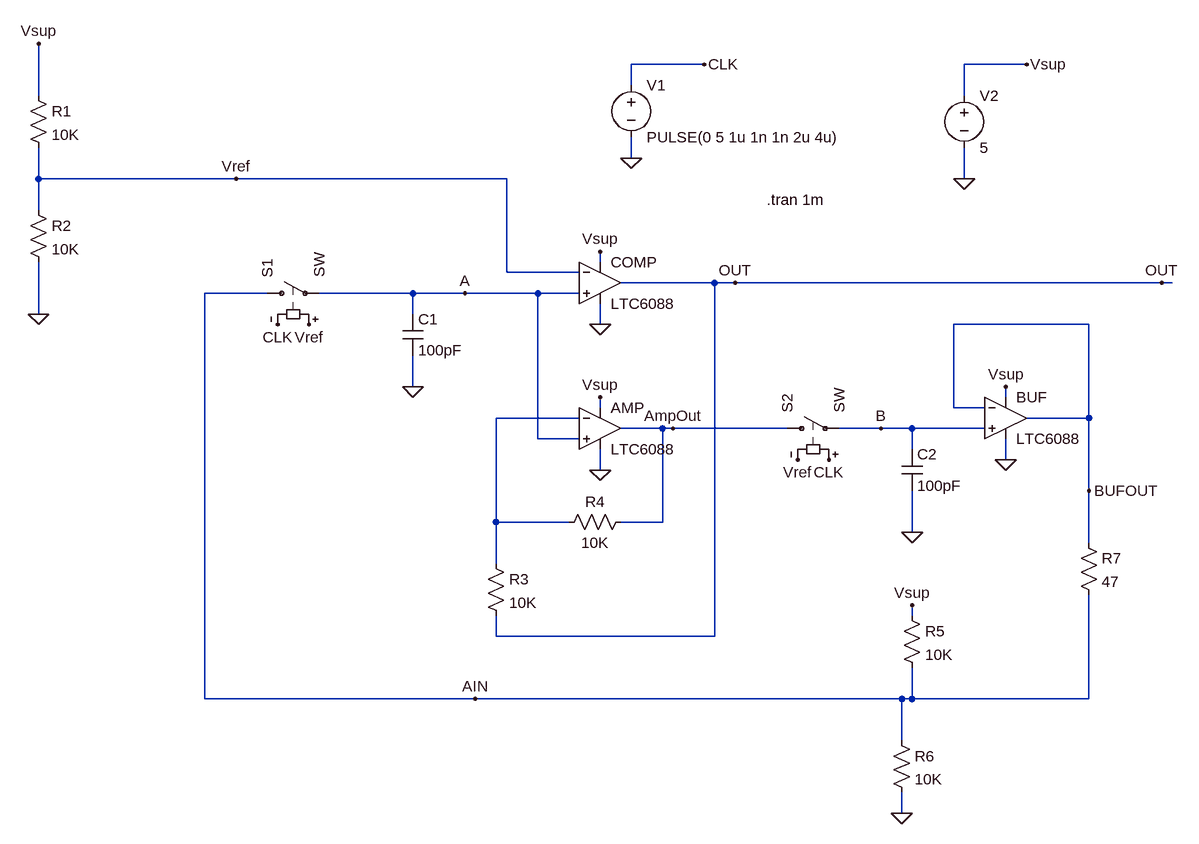
[diagram p0: schematic InfNoiseMult.asc]
InfNoiseMult.asc, the LTspice schematic file:
Version 4
SHEET 1 1396 1108
WIRE 384 -64 272 -64
WIRE 880 -64 784 -64
WIRE 272 -32 272 -64
WIRE -640 -16 -640 -96
WIRE 784 -16 784 -64
WIRE 272 80 272 48
WIRE -640 112 -640 64
WIRE -336 112 -640 112
WIRE 80 112 -336 112
WIRE 784 112 784 64
WIRE -640 160 -640 112
WIRE 224 240 224 224
WIRE 80 256 80 112
WIRE 192 256 80 256
WIRE 400 272 256 272
WIRE 432 272 400 272
WIRE 1088 272 432 272
WIRE 1104 272 1088 272
WIRE -288 288 -384 288
WIRE -64 288 -208 288
WIRE 16 288 -64 288
WIRE 128 288 16 288
WIRE 192 288 128 288
WIRE -640 320 -640 240
WIRE -64 320 -64 288
WIRE 224 336 224 304
WIRE 976 336 768 336
WIRE -64 432 -64 384
WIRE 848 448 848 432
WIRE 224 464 224 448
WIRE 768 464 768 336
WIRE 816 464 768 464
WIRE 192 480 64 480
WIRE 976 480 976 336
WIRE 976 480 880 480
WIRE 320 496 256 496
WIRE 336 496 320 496
WIRE 512 496 336 496
WIRE 656 496 592 496
WIRE 704 496 656 496
WIRE 816 496 704 496
WIRE 128 512 128 288
WIRE 192 512 128 512
WIRE 704 528 704 496
WIRE 848 544 848 512
WIRE 224 560 224 528
WIRE 976 592 976 480
WIRE 64 640 64 480
WIRE 176 640 64 640
WIRE 320 640 320 496
WIRE 320 640 256 640
WIRE 704 656 704 592
WIRE 976 672 976 592
WIRE 64 704 64 640
WIRE 704 784 704 768
WIRE 64 816 64 784
WIRE 400 816 400 272
WIRE 400 816 64 816
WIRE -384 912 -384 288
WIRE 32 912 -384 912
WIRE 688 912 32 912
WIRE 704 912 704 864
WIRE 704 912 688 912
WIRE 976 912 976 752
WIRE 976 912 704 912
WIRE 688 976 688 912
WIRE 688 1088 688 1056
FLAG -640 320 0
FLAG -640 -96 Vsup
FLAG -64 432 0
FLAG 704 656 0
FLAG 224 560 0
FLAG 224 336 0
FLAG 848 544 0
FLAG 224 224 Vsup
FLAG 224 448 Vsup
FLAG 848 432 Vsup
FLAG -272 336 CLK
FLAG 384 -64 CLK
FLAG -224 336 Vref
FLAG 528 544 Vref
FLAG 576 544 CLK
FLAG 784 112 0
FLAG 880 -64 Vsup
FLAG 688 1088 0
FLAG 704 768 Vsup
FLAG 16 288 A
FLAG 656 496 B
FLAG 976 592 BUFOUT
FLAG 32 912 AIN
FLAG 432 272 OUT
FLAG 1088 272 OUT
FLAG -336 112 Vref
FLAG 272 80 0
FLAG 336 496 AmpOut
SYMBOL Opamps\\LTC6088 224 272 R0
SYMATTR InstName COMP
SYMBOL Opamps\\LTC6088 224 496 R0
SYMATTR InstName AMP
SYMBOL Opamps\\LTC6088 848 480 R0
SYMATTR InstName BUF
SYMBOL res -656 -32 R0
SYMATTR InstName R1
SYMATTR Value 10K
SYMBOL res -656 144 R0
SYMATTR InstName R2
SYMATTR Value 10K
SYMBOL sw -304 288 R270
SYMATTR InstName S1
SYMBOL sw 496 496 R270
SYMATTR InstName S2
SYMBOL cap -80 320 R0
SYMATTR InstName C1
SYMATTR Value 100pF
SYMBOL res 48 688 R0
SYMATTR InstName R3
SYMATTR Value 10K
SYMBOL cap 688 528 R0
SYMATTR InstName C2
SYMATTR Value 100pF
SYMBOL voltage 272 -48 R0
WINDOW 123 0 0 Left 2
WINDOW 39 0 0 Left 2
SYMATTR InstName V1
SYMATTR Value PULSE(0 5 1u 1n 1n 2u 4u)
SYMBOL voltage 784 -32 R0
WINDOW 123 0 0 Left 2
WINDOW 39 0 0 Left 2
SYMATTR InstName V2
SYMATTR Value 5
SYMBOL res 160 656 R270
WINDOW 0 32 56 VTop 2
WINDOW 3 0 56 VBottom 2
SYMATTR InstName R4
SYMATTR Value 10K
SYMBOL res 960 656 R0
SYMATTR InstName R7
SYMATTR Value 47
SYMBOL res 688 768 R0
SYMATTR InstName R5
SYMATTR Value 10K
SYMBOL res 672 960 R0
SYMATTR InstName R6
SYMATTR Value 10K
TEXT 480 144 Left 2 !.tran 1m

The netlist it stands for:
* InfNoiseMult.asc
* COMP: LTC6088 (symbol Opamps\LTC6088 not available, pins judged from their places): In+=A In-=Vref V+=Vsup V-=0 OUT=OUT
* AMP: LTC6088 (symbol Opamps\LTC6088 not available, pins judged from their places): In+=A In-=N001 V+=Vsup V-=0 OUT=AmpOut
* BUF: LTC6088 (symbol Opamps\LTC6088 not available, pins judged from their places): In+=B In-=BUFOUT V+=Vsup V-=0 OUT=BUFOUT
R1 Vsup Vref 10K
R2 Vref 0 10K
S1 AIN A Vref CLK SW
S2 AmpOut B CLK Vref SW
C1 A 0 100pF
R3 N001 OUT 10K
C2 B 0 100pF
V1 CLK 0 PULSE(0 5 1u 1n 1n 2u 4u)
V2 Vsup 0 5
R4 N001 AmpOut 10K
R7 BUFOUT AIN 47
R5 Vsup AIN 10K
R6 AIN 0 10K
.tran 1m
.backanno
.end